# EAGLE design Codeshelf-0013.v00 (EAGLE 6.5.0)
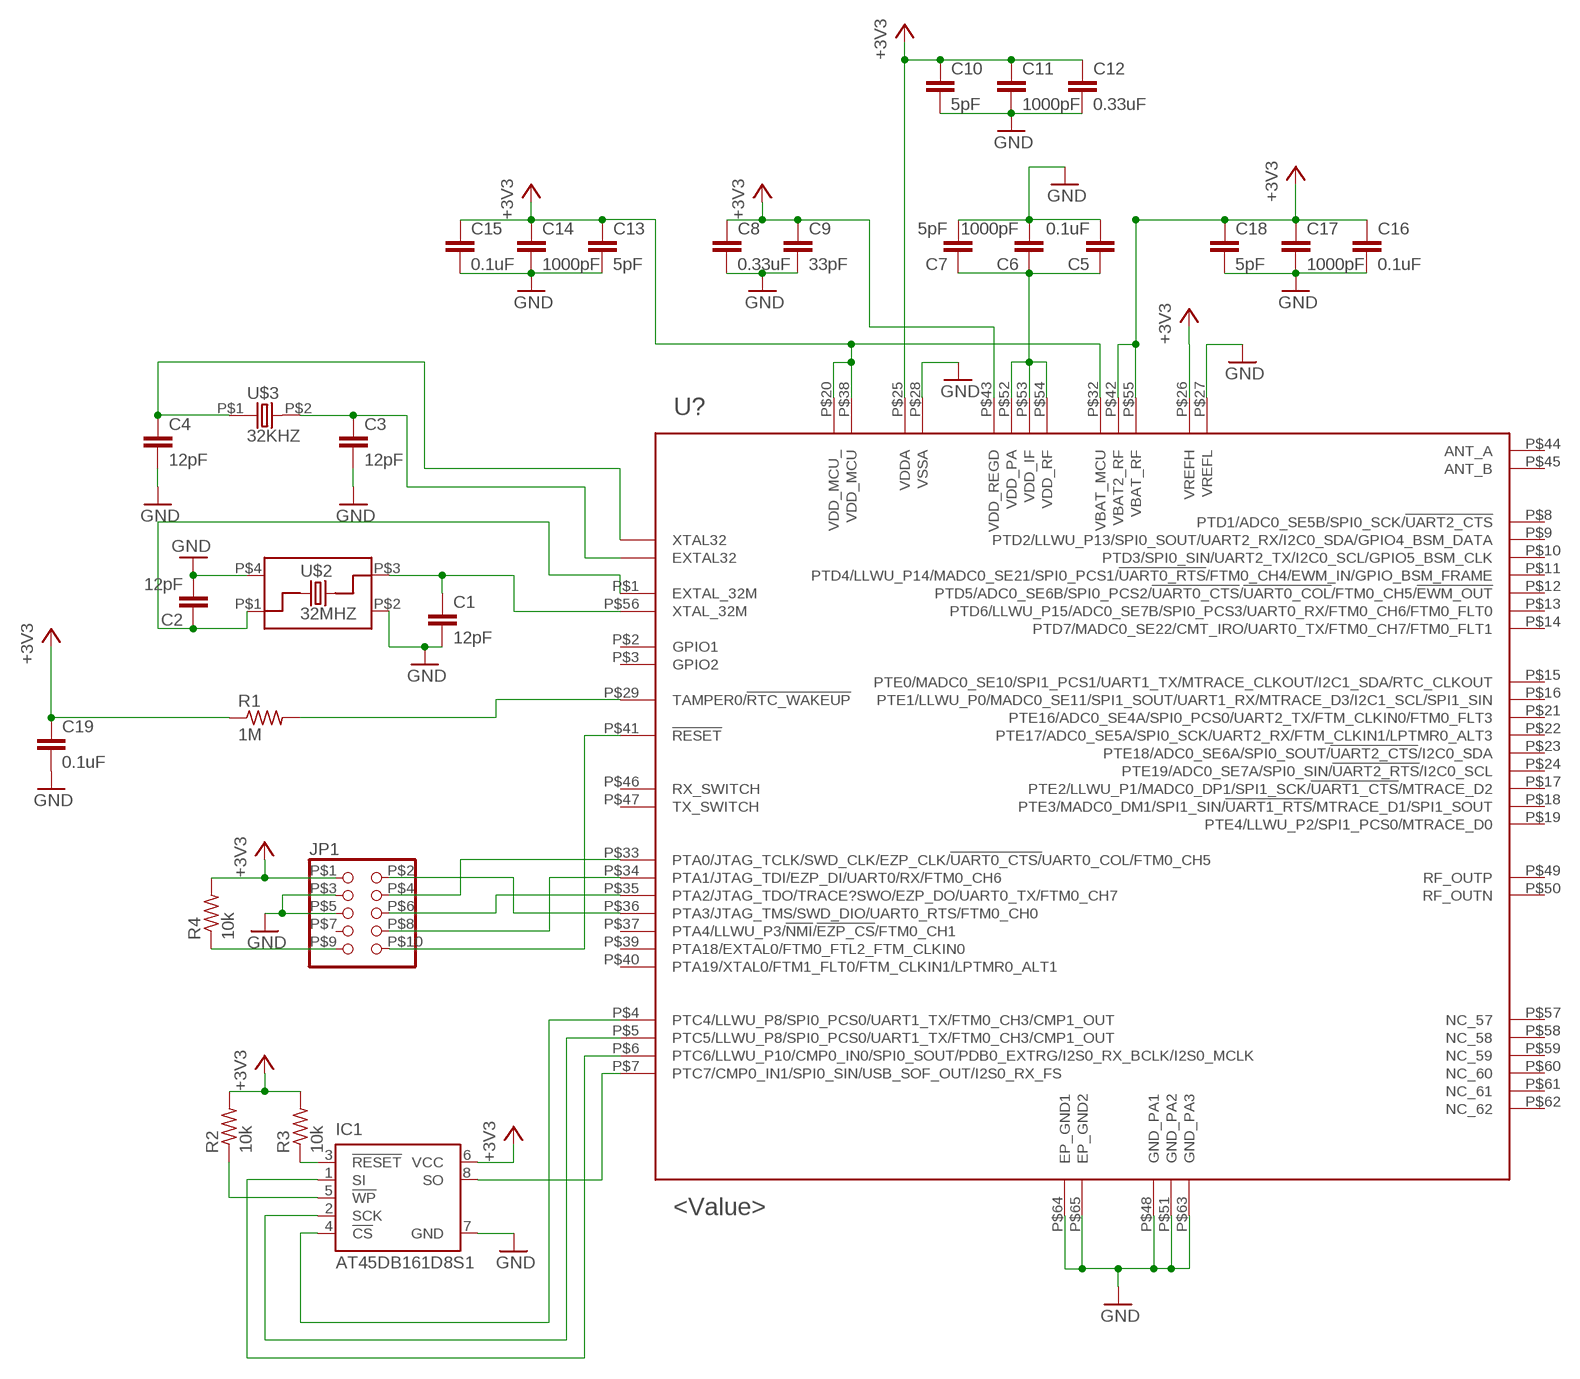
[diagram p0: schematic, sheet 1]

## Parts
C1  12pF  RF-C0402  [C0402]
C2  12pF  RF-C0402  [C0402]
C3  12pF  RF-C0402  [C0402]
C4  12pF  RF-C0402  [C0402]
C5  0.1uF  RF-C0402  [C0402]
C6  1000pF  RF-C0402  [C0402]
C7  5pF  RF-C0402  [C0402]
C8  0.33uF  RF-C0402  [C0402]
C9  33pF  RF-C0402  [C0402]
C10  5pF  RF-C0402  [C0402]
C11  1000pF  RF-C0402  [C0402]
C12  0.33uF  RF-C0402  [C0402]
C13  5pF  RF-C0402  [C0402]
C14  1000pF  RF-C0402  [C0402]
C15  0.1uF  RF-C0402  [C0402]
C16  0.1uF  RF-C0402  [C0402]
C17  1000pF  RF-C0402  [C0402]
C18  5pF  RF-C0402  [C0402]
C19  0.1uF  RF-C0402  [C0402]
IC1  AT45DB161D8S1  [8S1]
JP1  PINHD-2X5SMALL  [2X5HDR]
R1  1M  RF-R0402  [RF-R0402]
R2  10k  RF-R0402  [RF-R0402]
R3  10k  RF-R0402  [RF-R0402]
R4  10k  RF-R0402  [RF-R0402]
U$1  MKW21D  [LGA63]
U$2  32MHZ  [32MHZSMD]
U$3  32KHZ  [32KHZSMD]

## Nets
+3V3: C8.1 C9.1 C10.1 C11.1 C12.1 C13.1 C14.1 C15.1 C16.1 C17.1 C18.1 C19.1 IC1.6(VCC) JP1.P$1 R1.1 R2.2 R3.2 R4.2 U$1.P$20(VDD_MCU_) U$1.P$25(VDDA) U$1.P$26(VREFH) U$1.P$32(VBAT_MCU) U$1.P$38(VDD_MCU) U$1.P$42(VBAT2_RF) U$1.P$43(VDD_REGD) U$1.P$55(VBAT_RF)
CLKM1: C1.1 U$1.P$56(XTAL_32M) U$2.P$3
CLKM2: C2.1 U$1.P$1(EXTAL_32M) U$2.P$1
GND: C1.2 C2.2 C3.2 C4.2 C5.2 C6.2 C7.2 C8.2 C9.2 C10.2 C11.2 C12.2 C13.2 C14.2 C15.2 C16.2 C17.2 C18.2 C19.2 IC1.7(GND) JP1.P$3 JP1.P$5 U$1.P$27(VREFL) U$1.P$28(VSSA) U$1.P$48(GND_PA1) U$1.P$51(GND_PA2) U$1.P$63(GND_PA3) U$1.P$64(EP_GND1) U$1.P$65(EP_GND2) U$2.P$2 U$2.P$4
N$1: R1.2 U$1.P$29(TAMPER0/!RTC_WAKEUP)
N$3: C4.1 U$1.P$30(XTAL32) U$3.P$1
N$4: C3.1 U$1.P$31(EXTAL32) U$3.P$2
N$6: C5.1 C6.1 C7.1 U$1.P$52(VDD_PA) U$1.P$53(VDD_IF) U$1.P$54(VDD_RF)
N$7: IC1.4(!CS) U$1.P$4(PTC4/LLWU_P8/SPI0_PCS0/UART1_TX/FTM0_CH3/CMP1_OUT)
N$8: IC1.3(!RESET) R3.1
N$9: IC1.5(!WP) R2.1
N$10: JP1.P$2 U$1.P$36(PTA3/JTAG_TMS/SWD_DIO/UART0_RTS/FTM0_CH0)
N$11: JP1.P$4 U$1.P$33(PTA0/JTAG_TCLK/SWD_CLK/EZP_CLK/!UART0_CTS/!UART0_COL/FTM0_CH5)
N$12: JP1.P$6 U$1.P$35(PTA2/JTAG_TDO/TRACE?SWO/EZP_DO/UART0_TX/FTM0_CH7)
N$13: JP1.P$8 U$1.P$34(PTA1/JTAG_TDI/EZP_DI/UART0/RX/FTM0_CH6)
N$14: JP1.P$10 U$1.P$41(!RESET)
N$15: JP1.P$9 R4.1
N$16: IC1.2(SCK) U$1.P$5(PTC5/LLWU_P8/SPI0_PCS0/UART1_TX/FTM0_CH3/CMP1_OUT)
N$17: IC1.1(SI) U$1.P$6(PTC6/LLWU_P10/CMP0_IN0/SPI0_SOUT/PDB0_EXTRG/I2S0_RX_BCLK/I2S0_MCLK)
N$18: IC1.8(SO) U$1.P$7(PTC7/CMP0_IN1/SPI0_SIN/USB_SOF_OUT/I2S0_RX_FS)
Unconnected: JP1.P$7 U$1.P$2(GPIO1) U$1.P$3(GPIO2) U$1.P$8(PTD1/ADC0_SE5B/SPI0_SCK/!UART2_CTS) U$1.P$9(PTD2/LLWU_P13/SPI0_SOUT/UART2_RX/I2C0_SDA/GPIO4_BSM_DATA) U$1.P$10(PTD3/SPI0_SIN/UART2_TX/I2C0_SCL/GPIO5_BSM_CLK) U$1.P$11(PTD4/LLWU_P14/MADC0_SE21/SPI0_PCS1/!UART0_RTS!/FTM0_CH4/EWM_IN/GPIO_BSM_FRAME) U$1.P$12(PTD5/ADC0_SE6B/SPI0_PCS2/!UART0_CTS!/!UART0_COL!/FTM0_CH5/!EWM_OUT) U$1.P$13(PTD6/LLWU_P15/ADC0_SE7B/SPI0_PCS3/UART0_RX/FTM0_CH6/FTM0_FLT0) U$1.P$14(PTD7/MADC0_SE22/CMT_IRO/UART0_TX/FTM0_CH7/FTM0_FLT1) U$1.P$15(PTE0/MADC0_SE10/SPI1_PCS1/UART1_TX/MTRACE_CLKOUT/I2C1_SDA/RTC_CLKOUT) U$1.P$16(PTE1/LLWU_P0/MADC0_SE11/SPI1_SOUT/UART1_RX/MTRACE_D3/I2C1_SCL/SPI1_SIN) U$1.P$17(PTE2/LLWU_P1/MADC0_DP1/SPI1_SCK/!UART1_CTS!/MTRACE_D2) U$1.P$18(PTE3/MADC0_DM1/SPI1_SIN/!UART1_RTS!/MTRACE_D1/SPI1_SOUT) U$1.P$19(PTE4/LLWU_P2/SPI1_PCS0/MTRACE_D0) U$1.P$21(PTE16/ADC0_SE4A/SPI0_PCS0/UART2_TX/FTM_CLKIN0/FTM0_FLT3) U$1.P$22(PTE17/ADC0_SE5A/SPI0_SCK/UART2_RX/FTM_CLKIN1/LPTMR0_ALT3) U$1.P$23(PTE18/ADC0_SE6A/SPI0_SOUT/!UART2_CTS!/I2C0_SDA) U$1.P$24(PTE19/ADC0_SE7A/SPI0_SIN/!UART2_RTS!/I2C0_SCL) U$1.P$37(PTA4/LLWU_P3/!NMI!/!EZP_CS!/FTM0_CH1) U$1.P$39(PTA18/EXTAL0/FTM0_FTL2_FTM_CLKIN0) U$1.P$40(PTA19/XTAL0/FTM1_FLT0/FTM_CLKIN1/LPTMR0_ALT1) U$1.P$44(ANT_A) U$1.P$45(ANT_B) U$1.P$46(RX_SWITCH) U$1.P$47(TX_SWITCH) U$1.P$49(RF_OUTP) U$1.P$50(RF_OUTN) U$1.P$57(NC_57) U$1.P$58(NC_58) U$1.P$59(NC_59) U$1.P$60(NC_60) U$1.P$61(NC_61) U$1.P$62(NC_62)

## Library data of the parts
C1-C19 = GW-devices:RF-C: RF capacitor pads for FSL reference design
IC1 = KW2:AT45DB161D: 16-megabit 2.5V or 2.7V DataFlash Source: http://www.atmel.com/dyn/resources/prod_documents/doc3500.pdf
JP1 = KW2:PINHD-2X5: PIN HEADER
R1-R4 = GW-devices:RF-R: RF resistor pads for FSL reference design
U$1 = ZIGBEE:MKW21D: Freescale's new Kinetis KW20 wireless MCUs expands on the successful Kinetis MCU family based on the ARM® Cortex™-M4 CPU core. The Kinetis KW20 Wireless MCU integrates a class-leading RF transceiver, Cortex™-M4 and a robust feature set for reliable, secure, and low-power IEEE® 802.15.4 wireless solutions. Product Summary Page: http://www.freescale.com/webapp/sps/site/prod_summary.jsp?code=KW20 Datasheet: http://cache.freescale.com/files/rf_if/doc/data_sheet/MKW22D512V.pdf
U$2 = KW2:32MHZ: 32Mhz crystal for KW2 radio
U$3 = KW2:32KHZ

## Board
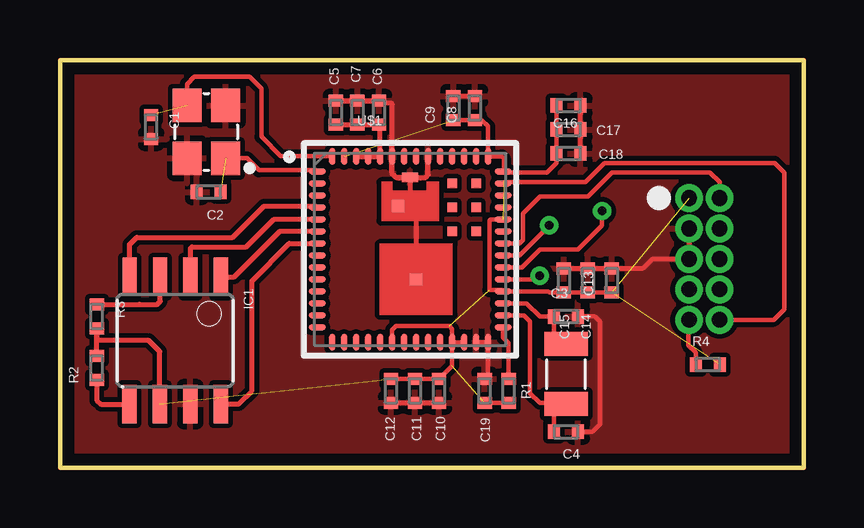
[diagram p1: board, top side]
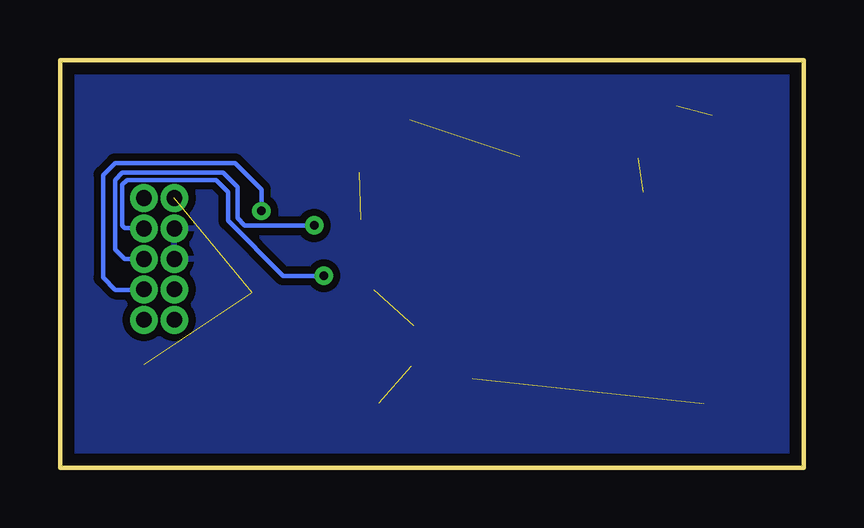
[diagram p2: board, bottom side, seen from below]

Size 31 x 17 mm. Coordinates in mm from the lower left corner, seen from the top.
Outline: 0,0 0,17 31,17 31,0 0,0
Copper layers (1*16): Top 0.0356mm / dielectric 1.5011mm / Bottom 0.0356mm
Design rules "SilverCircuits": minimum track width 7mil, minimum drill 14mil, track to track 7mil, track to pad 7mil, pad to pad 7mil, via to via 7mil, smd to smd 0mil, copper to edge 20mil, drill to drill 8mil, minimum pad ring 10mil, minimum via ring 8mil, stop-mask expansion 4mil, vias tented up to drill 0mil, thermal gap 10mil

### Footprints (pad centres in the part's own frame; a part is rotated, then mirrored left to right if it is on the bottom)
C0402 = smd 0.5 x 0.6: 1 -0.5,0; 2 0.5,0
8S1 = smd 0.6 x 1.6: 1 -1.905,-2.654; 2 -0.645,-2.654; 3 0.625,-2.654; 4 1.895,-2.654; 5 1.905,2.654; 6 0.635,2.654; 7 -0.635,2.654; 8 -1.905,2.654
2X5HDR = drill 0.65: P$1 -2.54,-1.27; P$2 -2.54,0; P$3 -1.27,-1.27; P$4 -1.27,0; P$5 0,-1.27; P$6 0,0; P$7 1.27,-1.27; P$8 1.27,0; P$9 2.54,-1.27; P$10 2.54,0
RF-R0402 = smd 0.5 x 0.6: 1 -0.5,0; 2 0.5,0
LGA63 = smd 0.711 x 0.254: P$1 0.125,7.25; P$2 0.125,6.75; P$3 0.125,6.25; P$4 0.125,5.75; P$5 0.125,5.25; P$6 0.125,4.75; P$7 0.135,4.25; P$8 0.135,3.75; P$9 0.125,3.25; P$10 0.125,2.75; P$11 0.125,2.25; P$12 0.125,1.75; P$13 0.125,1.25; P$14 0.125,0.75; P$29 7.875,0.75; P$30 7.875,1.25; P$31 7.875,1.75; P$32 7.875,2.25; P$33 7.875,2.75; P$34 7.875,3.25; P$35 7.885,3.75; P$36 7.885,4.25; P$37 7.875,4.75; P$38 7.875,5.25; P$39 7.875,5.75; P$40 7.875,6.25; P$41 7.875,6.75; P$42 7.875,7.25 | smd 0.254 x 0.711: P$15 0.75,0.125; P$16 1.25,0.125; P$17 1.75,0.125; P$18 2.25,0.125; P$19 2.75,0.125; P$20 3.25,0.125; P$21 3.75,0.135; P$22 4.25,0.135; P$23 4.75,0.125; P$24 5.25,0.125; P$25 5.75,0.125; P$26 6.25,0.125; P$27 6.75,0.125; P$28 7.25,0.125; P$43 7.25,7.875; P$44 6.75,7.875; P$45 6.25,7.875; P$46 5.75,7.875; P$47 5.25,7.874; P$48 4.751,7.874; P$49 4.25,7.874; P$50 3.75,7.875; P$51 3.25,7.875; P$52 2.75,7.875; P$53 2.25,7.875; P$54 1.75,7.875; P$55 1.25,7.875; P$56 0.75,7.875 | smd 0.406 x 0.406: P$57 5.75,6.75; P$58 6.75,6.75; P$59 5.75,5.75; P$60 6.75,5.75; P$61 5.75,4.75; P$62 6.75,4.75 | smd 0.66 x 0.406: P$63 4,7 | smd 0.5 x 0.5: P$64 3.5,5.812; P$65 4.25,2.75
32MHZSMD = smd 1.4 x 1.2: P$1 -1.1,-0.8; P$2 1.1,-0.8; P$3 1.1,0.8; P$4 -1.1,0.8
32KHZSMD = smd 1 x 1.8: P$1 1.25,0; P$2 -1.25,0

### Placement (x,y rotation side)
C1  3.8,14.2 270 top
C2  6.2,11.5 180 top
C3  21.1,6.3 0 top
C4  21.1,1.5 0 top
C5  11.5,14.8 90 top
C6  13.3,14.8 90 top
C7  12.4,14.8 90 top
C8  17.3,15 90 top
C9  16.4,15 90 top
C10  15.8,3.2 270 top
C11  14.8,3.2 270 top
C12  13.8,3.2 270 top
C13  23,7.8 90 top
C14  22,7.8 90 top
C15  21,7.8 90 top
C16  21.2,15.1 0 top
C17  21.2,14.1 0 top
C18  21.2,13.1 0 top
C19  17.7,3.2 90 top
IC1  4.8,5.3 180 top
JP1  27.5,8.7 270 top
R1  18.7,3.2 90 top
R2  1.54,4.15 90 top
R3  1.54,6.31 270 top
R4  27,4.3 0 top
U$1  10.6,5.1 0 top
U$2  6.1,14 90 top
U$3  21.1,3.9 270 top

### Tracks (layer width: path | path; a pad name or v marks a point on that pad's centre or on a via)
+3V3  (7 unrouted)
  Top 0.178: 13.9,3.7 C12.1 13.9,3.7 | 13.9,3.7 C11.1 14.9,3.7 C10.1 16.35,4.25 U$1.P$25 | U$1.P$20 13.85,5.75 14,5.9 16.23,5.9 16.35,5.78 U$1.P$25 | U$1.P$25 | C19.1 R1.1 | C16.1 C17.1 C18.1 20.7,12.7 20.3,12.3 18.52,12.3 U$1.P$42 18.5,12.38 18.5,12.9 18.42,12.98 U$1.P$43 17.84,14.23 17.58,14.5 C8.1 C9.1 | U$1.P$55 11.83,12.98 11.8,13 | U$1.P$38 17.95,10.35 17.9,10.3 17.9,7.4 18.42,7.4 U$1.P$32 20.35,7.35 20.4,7.3 C15.1 C14.1 C13.1
  Top 0.203: U$1.P$25 U$1.P$26 | R2.2 R3.2 1.55,5.3 3.7,5.3 4.16,4.84 IC1.6
CLKM1  (1 unrouted)
  Top 0.178: U$2.P$3 5.3,16 5.6,16.3 7.9,16.3 8.4,15.8 8.4,13.8 9.2,13 11.33,13 U$1.P$56
CLKM2  (1 unrouted)
  Top 0.178: U$2.P$1 7.8,12.9 8.3,12.4 10.67,12.4 U$1.P$1
GND
  Top 0.178: C12.2 C11.2 14.9,2.7 C10.2 | U$1.P$28 17.85,3.85 C19.2 | C3.2 22.3,6.3 22.5,6.1 22.5,1.8 22.2,1.5 C4.2 | C18.2 21.7,13 C17.2 C16.2 | C8.2 C9.2 | JP1.P$3 JP1.P$5 24.7,8.7 24.3,8.3 C13.2 C14.2 C15.2
  Top 0.203: 14,11.41 U$1.P$64 14.51,10.91 | U$1.P$63 14,12.1 | 14,12.1 13.85,12.25 U$1.P$51 | U$1.P$51 | 6.82,15.31 U$2.P$2 6.81,15.02 | 5.53,12.8 U$2.P$4 | U$1.P$27 U$1.P$28 | U$1.P$63 15.25,12.1 15.35,12.2 U$1.P$48 | 14,12.1 U$1.P$63 | U$1.P$63 14.6,11 14.51,10.91 | 14.51,10.91 14.85,10.57 U$1.P$65 | IC1.7 5.44,2.66 5.4,2.7 | C5.2 C7.2 C6.2 13.4,15.2 13.8,15.2 13.85,15.15 U$1.P$51
  pour Top (isolate 0.2, rank 2): 0,17 31,17 31,0 0,0
  pour Bottom (isolate 0.305, rank 2): 0,17 31,17 31,0 0,0
N$1
  Top 0.178: U$1.P$29 18.48,5.43 18.7,5.2 R1.2
N$3
  Top 0.178: U$1.P$30 19.35,6.35 19.6,6.1 19.6,3.1 20,2.7 20.6,2.7 | 20.6,2.7 21.05,2.7 U$3.P$1 | C4.1 20.6,2.7
N$4
  Top 0.178: U$3.P$2 20.6,5.65 C3.1 20,6.3 19.45,6.85 U$1.P$31
N$6
  Top 0.203: U$1.P$54 U$1.P$53 U$1.P$52 13.35,14.25 C6.1 C7.1 C5.1
N$7
  Top 0.203: IC1.4 2.91,9.3 3.2,9.6 7.2,9.6 8.5,10.9 10.67,10.9 U$1.P$4
N$8
  Top 0.203: R3.1 3.3,6.81 4.05,6.81 4.18,6.94 IC1.3 4.16,7.93
N$9
  Top 0.203: 2.79,2.75 IC1.5 1.71,2.64 1.54,2.81 R2.1
N$10
  Top 0.178: JP1.P$2 27.5,11.2 27.5,11.9 27.1,12.3 23,12.3 22,11.3 20,11.3 19.7,11 19.3,10.6 19.3,9.5 19.15,9.35 U$1.P$36
N$11  (via drill 0.36)
  Top 0.178: U$1.P$33 19.85,7.85 v20,8
  Bottom 0.178: v20,8 21.7,8 24,10.3 24,11.5 24.5,12 28.2,12 28.4,11.8 28.4,10.1 28.3,10 27.53,10 JP1.P$4
N$12  (via drill 0.36)
  Top 0.178: U$1.P$35 19.15,8.85 19.9,9.6 20,9.7 v20.4,10.1
  Bottom 0.178: JP1.P$6 28.3,8.7 28.7,9.1 28.7,12 28.4,12.3 24.3,12.3 24.2,12.3 23.6,11.7 23.6,10.4 23.3,10.1 23.2,10.1 v20.4,10.1
N$13  (via drill 0.36)
  Top 0.178: JP1.P$8 27.5,7.4 | U$1.P$34 19.15,8.35 19.25,8.35 20,9.1 21.6,9.1 22.6,10.1 v22.6,10.7
  Bottom 0.178: v22.6,10.7 22.6,11.6 23.7,12.7 28.7,12.7 29.2,12.2 29.2,7.92 28.69,7.41 27.52,7.41 JP1.P$8
N$14
  Top 0.178: JP1.P$10 29.76,6.16 30.2,6.6 30.2,12.3 29.8,12.7 22.7,12.7 21.9,11.9 18.52,11.9 U$1.P$41
N$15
  Top 0.178: R4.1 26.5,4.8 26.2,5.1 26.2,6.13 JP1.P$9
N$16
  Top 0.203: IC1.2 5.45,9.14 5.5,9.2 7.77,9.2 8.93,10.36 10.71,10.36 U$1.P$5
N$17
  Top 0.203: IC1.1 7.27,7.95 9.17,9.86 U$1.P$6
N$18
  Top 0.203: IC1.8 7.45,2.65 8,3.2 8,7.79 9.56,9.35 U$1.P$7 | U$1.P$7